# Altium project Sterownik.PrjPcb (part 2 of 2)
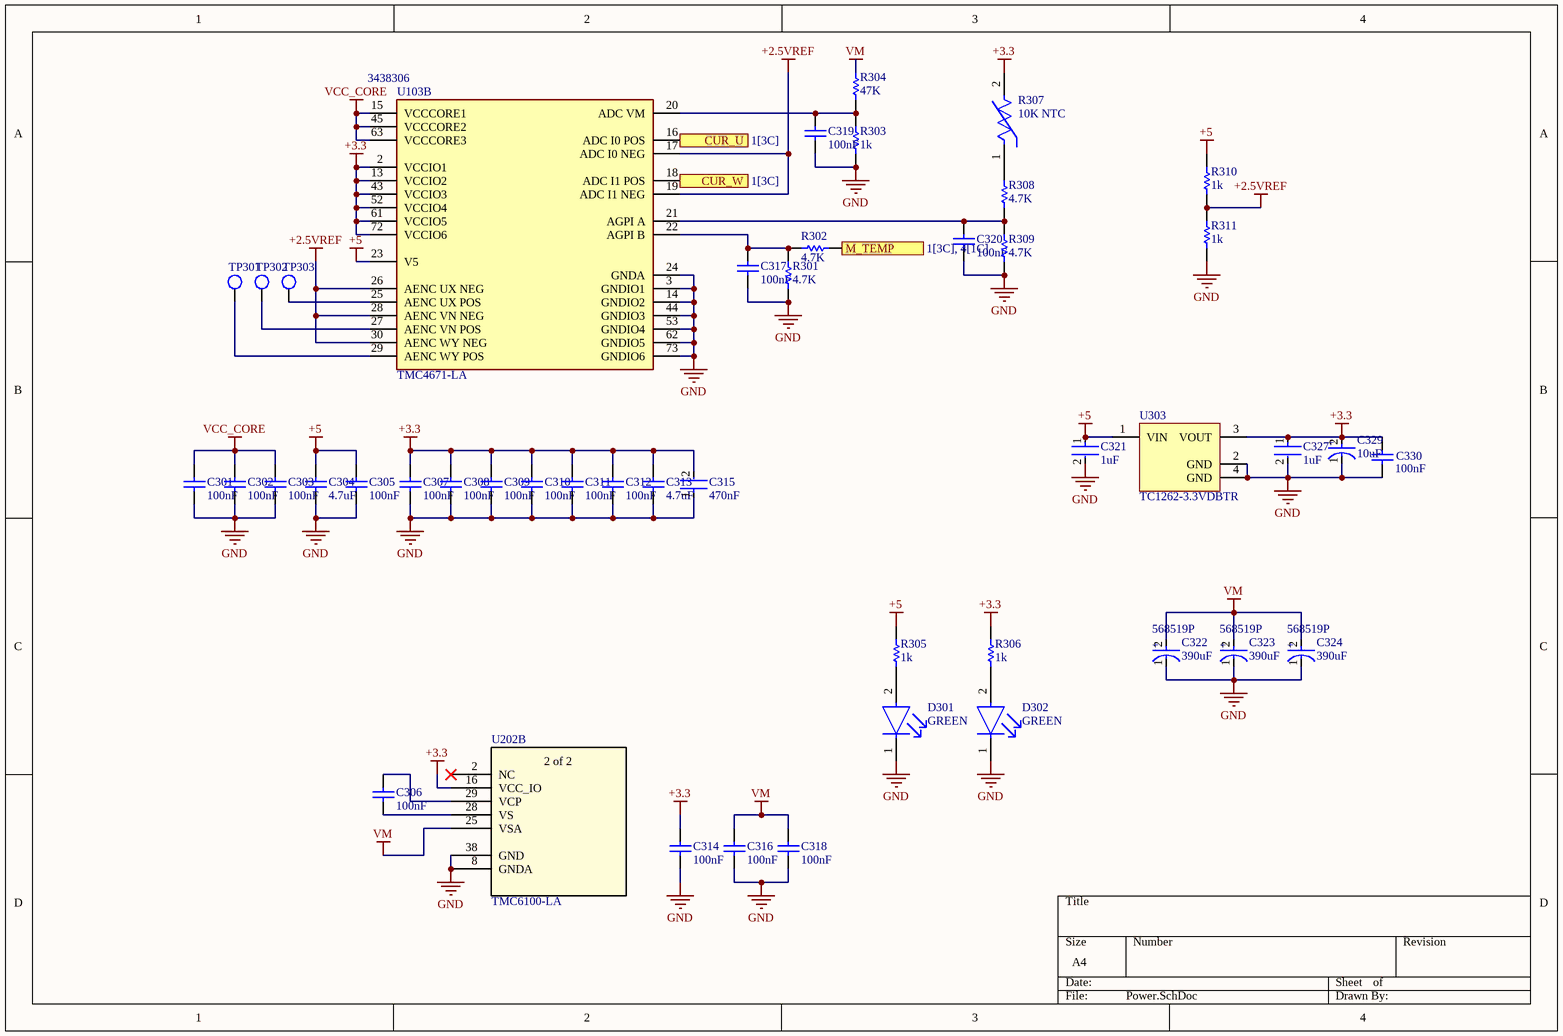
[diagram p5: Power.SchDoc]

## Nets that join several sheets
+2.5VREF: TMC6100 (6 pins), Power (7 pins)
+3.3: TMC4671 (6 pins), TMC6100 (R201.2), Connectors (P403.2 P404.2 P405.1), Power (22 pins)
+5: TMC4671 (6 pins), TMC6100 (C211.1 C212.1 U201.6 U203.6), Connectors (J402.4 J403.5 J404.5 J405.6), Power (7 pins)
GND: TMC4671 (16 pins), TMC6100 (12 pins), Connectors (15 pins), MOSFETs (12 pins), Power (43 pins)
VM: Connectors (*401.1 D402.2), MOSFETs (15 pins), Power (7 pins)
NetC202_2: TMC6100 (C202.2 R202.2), Power (U103.16)
NetC203_2: TMC6100 (C203.2 U201.8 U202.36), MOSFETs (8 pins)
NetC205_2: TMC6100 (C205.2 U202.33), Connectors (P410.2), MOSFETs (7 pins)
NetC206_2: TMC6100 (C206.2 U202.32 U203.8), MOSFETs (8 pins)
NetC210_2: TMC6100 (C210.2 R203.2), Power (U103.18)
NetJ403_2: TMC4671 (R105.1 R110.1), Connectors (J403.2)
NetJ403_3: TMC4671 (R103.1 R108.1), Connectors (J403.3)
NetJ403_4: TMC4671 (R101.1 R107.1), Connectors (J403.4)
NetJ404_2: TMC4671 (R106.1 R112.2), Connectors (J404.2)
NetJ404_3: TMC4671 (R104.1 R111.2), Connectors (J404.3)
NetJ404_4: TMC4671 (R102.1 R109.2), Connectors (J404.4)
NetJ405_2: TMC4671 (U103.7), TMC6100 (U202.11), Connectors (J405.2 P404.3)
NetJ405_4: TMC4671 (U103.8), TMC6100 (U202.12), Connectors (J405.4 P404.4)
NetJ405_5: TMC4671 (U103.9), TMC6100 (U202.13), Connectors (J405.5 P404.1)
NetP403_1: Connectors (P403.1), Power (R302.2)
NetP405_3: TMC4671 (U103.75), Connectors (P405.3)
NetP405_4: TMC4671 (U103.4), Connectors (P405.4)
NetP405_5: TMC4671 (U103.76), Connectors (P405.5)
NetP405_6: TMC4671 (U103.5), Connectors (P405.6)
NetP405_7: TMC4671 (U103.1), Connectors (P405.7)
NetP406_1: TMC4671 (U103.31), Connectors (P406.1)
NetP408_1: TMC4671 (U103.11), Connectors (P408.1)
NetP408_2: TMC4671 (U103.10), Connectors (P408.2)
NetP409_1: TMC4671 (U103.57), Connectors (P409.1)
NetP409_2: TMC4671 (U103.56), Connectors (P409.2)
NetP410_1: TMC6100 (U201.1), Connectors (P410.1), MOSFETs (R603.2)
NetP410_3: TMC6100 (U203.1), Connectors (P410.3), MOSFETs (R608.2)
NetR601_1: TMC6100 (U202.37), MOSFETs (R601.1)
NetR602_1: TMC6100 (U202.5), MOSFETs (R602.1)
NetR604_1: TMC6100 (U202.34), MOSFETs (R604.1)
NetR605_1: TMC6100 (U202.4), MOSFETs (R605.1)
NetR606_1: TMC6100 (U202.31), MOSFETs (R606.1)
NetR607_1: TMC6100 (U202.3), MOSFETs (R607.1)
NetU103_32: TMC4671 (U103.32), TMC6100 (U202.24)
NetU103_39: TMC4671 (U103.39), TMC6100 (U202.14)
NetU103_40: TMC4671 (U103.40), TMC6100 (U202.15)
NetU103_41: TMC4671 (U103.41), TMC6100 (U202.17)
NetU103_42: TMC4671 (U103.42), TMC6100 (U202.18)
NetU103_46: TMC4671 (U103.46), TMC6100 (U202.19)
NetU103_47: TMC4671 (U103.47), TMC6100 (U202.20)

## Assembly variants
Prefered: not fitted C102 C105 C107 C109 J403 J404 P403 P404 P405 P406 P408 P409 R102 R104 R106 R109 R111 R112 U102
Full: all parts fitted